# EAGLE design ezlpc-proto (EAGLE 6.5.0)
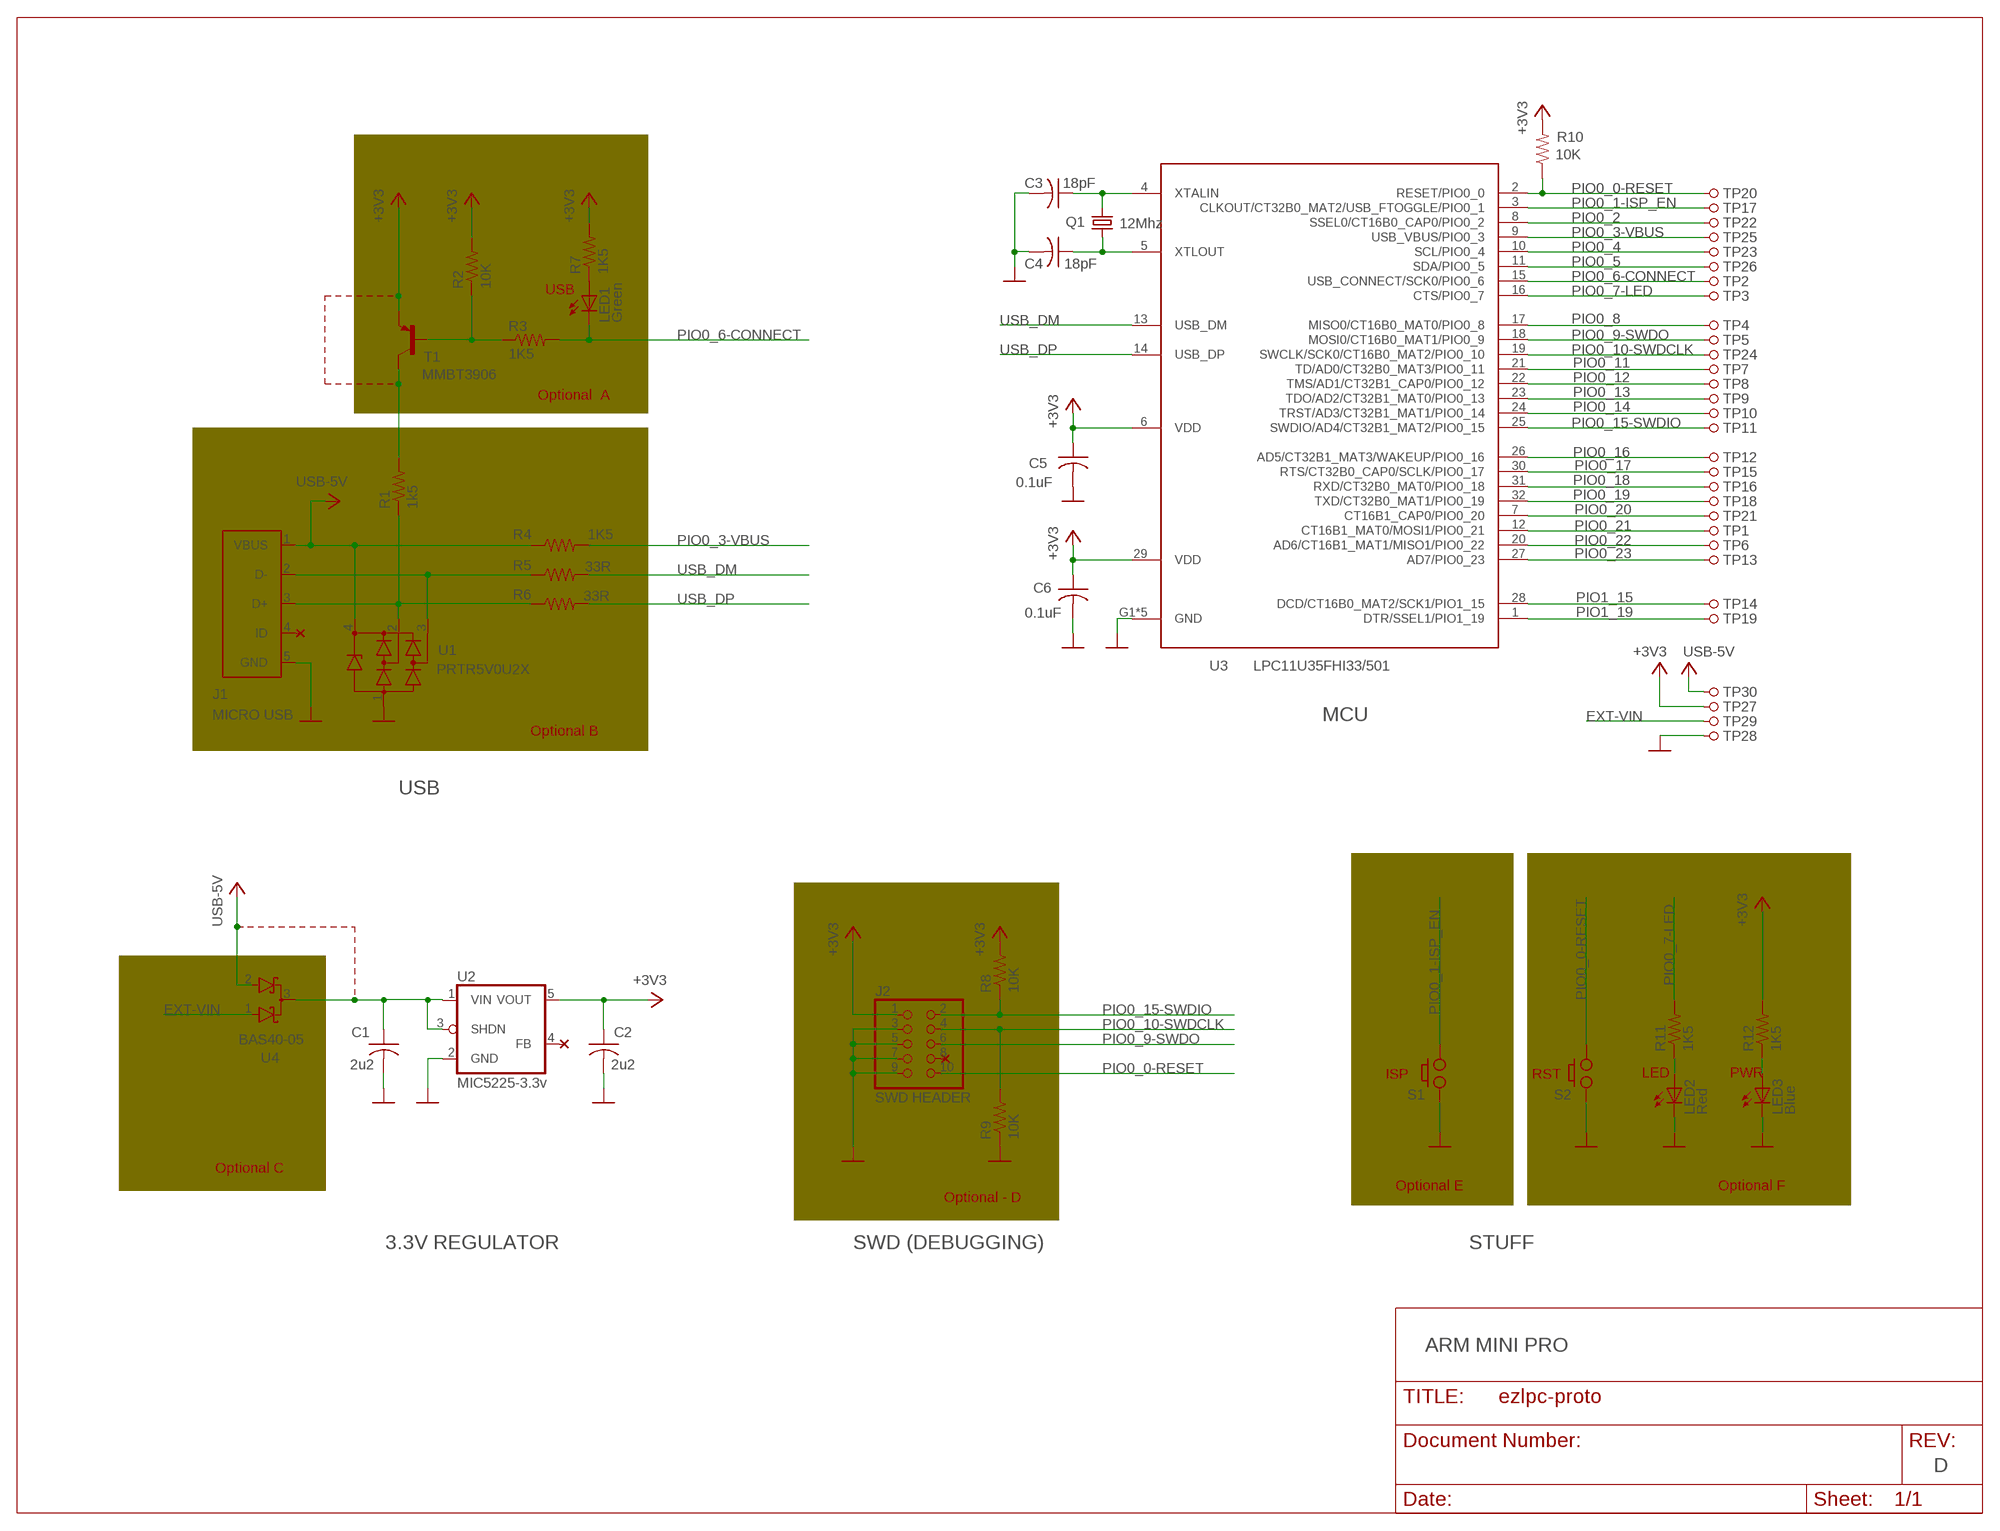
[diagram p0: schematic, sheet 1]

## Parts
C1  2u2  CAPACITORC0603K  [C0603K]
C2  2u2  CAPACITORC0603K  [C0603K]
C3  18pF  C-USC0402K  [C0402K]
C4  18pF  C-USC0402K  [C0402K]
C5  0.1uF  CAPACITORC0603K  [C0603K]
C6  0.1uF  CAPACITORC0603K  [C0603K]
J1  MICRO USB  USB  [USB-MICRO-ZX62RD-AB-5P8]
J2  SWD HEADER  SWD-HEADER  [SWD-HEADER]
LED1  Green  LEDCHIP-LED0603  [CHIP-LED0603]
LED2  Red  LEDCHIP-LED0603  [CHIP-LED0603]
LED3  Blue  LEDCHIP-LED0603  [CHIP-LED0603]
Q1  12Mhz  CRYSTALCTS406  [CRYSTAL]
R1  1k5  R-US_R0402  [R0402]
R2  10K  R-US_R0402  [R0402]
R3  1K5  R-US_R0402  [R0402]
R4  1K5  R-US_R0402  [R0402]
R5  33R  R-US_R0402  [R0402]
R6  33R  R-US_R0402  [R0402]
R7  1K5  R-US_R0402  [R0402]
R8  10K  R-US_R0402  [R0402]
R9  10K  R-US_R0402  [R0402]
R10  10K  R-US_R0402  [R0402]
R11  1K5  R-US_R0402  [R0402]
R12  1K5  R-US_R0402  [R0402]
S1  PUSH_BUTTON  [PUSH_BUTTON]
S2  PUSH_BUTTON  [PUSH_BUTTON]
T1  MMBT3906  BC857B-PNP-SOT23-BEC  [SOT23-BEC]
TP1  HDR1  PINHD-1X1SQUARE  [1X01-SQUARE]
TP2  HDR1  PINHD-1X1  [1X01]
TP3  HDR1  PINHD-1X1  [1X01]
TP4  HDR1  PINHD-1X1  [1X01]
TP5  HDR1  PINHD-1X1  [1X01]
TP6  HDR1  PINHD-1X1  [1X01]
TP7  HDR1  PINHD-1X1  [1X01]
TP8  HDR1  PINHD-1X1  [1X01]
TP9  HDR1  PINHD-1X1  [1X01]
TP10  HDR1  PINHD-1X1  [1X01]
TP11  HDR1  PINHD-1X1  [1X01]
TP12  HDR1  PINHD-1X1  [1X01]
TP13  HDR1  PINHD-1X1  [1X01]
TP14  HDR1  PINHD-1X1  [1X01]
TP15  HDR1  PINHD-1X1  [1X01]
TP16  HDR1  PINHD-1X1  [1X01]
TP17  HDR1  PINHD-1X1  [1X01]
TP18  HDR1  PINHD-1X1  [1X01]
TP19  HDR1  PINHD-1X1  [1X01]
TP20  HDR1  PINHD-1X1  [1X01]
TP21  HDR1  PINHD-1X1  [1X01]
TP22  HDR1  PINHD-1X1  [1X01]
TP23  HDR1  PINHD-1X1  [1X01]
TP24  HDR1  PINHD-1X1  [1X01]
TP25  HDR1  PINHD-1X1  [1X01]
TP26  HDR1  PINHD-1X1  [1X01]
TP27  HDR1  PINHD-1X1  [1X01]
TP28  HDR1  PINHD-1X1  [1X01]
TP29  HDR1  PINHD-1X1  [1X01]
TP30  HDR1  PINHD-1X1  [1X01]
U1  PRTR5V0U2X  [SOT143B]
U2  MIC5225-3.3v  TC1015  [SOT25]
U3  LPC11U35FHI33/501  LPC11U35FHN33/501  [HVQFN33-5MM]
U4  BAS40-05  [SOT23]

## Nets
+3V3: C2.1 C5.1 C6.1 J2.1 R2.2 R7.2 R8.2 R10.2 R12.2 T1.E TP27.1 U2.5(VOUT) U3.6(VDD) U3.29(VDD)
EXT-VIN: TP29.1 U4.1(A1)
GND: C1.2 C2.2 C3.2 C4.2 C5.2 C6.2 J1.5(GND) J2.3 J2.5 J2.7 J2.9 LED2.C LED3.C R9.1 S1.A1 S2.A1 TP28.1 U1.1(GND) U2.2(GND) U3.G1(GND) U3.G2(GND) U3.G3(GND) U3.G4(GND) U3.TAB(GND)
N$1: C3.1 Q1.3 U3.4(XTALIN)
N$2: LED3.A R12.1
N$3: C4.1 Q1.1 U3.5(XTLOUT)
N$4: R2.1 R3.1 T1.B
N$5: R1.2 T1.C
N$6: LED2.A R11.1
N$7: LED1.A R7.1
N$8: J1.3(D+) R1.1 R6.1 U1.2(IO1)
N$9: J1.2(D-) R5.1 U1.3(IO2)
N$10: C1.1 U2.1(VIN) U2.3(SHDN) U4.3(C)
PIO0_0-RESET: J2.10 R10.1 S2.B2 TP20.1 U3.2(RESET/PIO0_0)
PIO0_1-ISP_EN: S1.B2 TP17.1 U3.3(CLKOUT/CT32B0_MAT2/USB_FTOGGLE/PIO0_1)
PIO0_2: TP22.1 U3.8(SSEL0/CT16B0_CAP0/PIO0_2)
PIO0_3-VBUS: R4.2 TP25.1 U3.9(USB_VBUS/PIO0_3)
PIO0_4: TP23.1 U3.10(SCL/PIO0_4)
PIO0_5: TP26.1 U3.11(SDA/PIO0_5)
PIO0_6-CONNECT: LED1.C R3.2 TP2.1 U3.15(USB_CONNECT/SCK0/PIO0_6)
PIO0_7-LED: R11.2 TP3.1 U3.16(CTS/PIO0_7)
PIO0_8: TP4.1 U3.17(MISO0/CT16B0_MAT0/PIO0_8)
PIO0_9-SWDO: J2.6 TP5.1 U3.18(MOSI0/CT16B0_MAT1/PIO0_9)
PIO0_10-SWDCLK: J2.4 R9.2 TP24.1 U3.19(SWCLK/SCK0/CT16B0_MAT2/PIO0_10)
PIO0_11: TP7.1 U3.21(TD/AD0/CT32B0_MAT3/PIO0_11)
PIO0_12: TP8.1 U3.22(TMS/AD1/CT32B1_CAP0/PIO0_12)
PIO0_13: TP9.1 U3.23(TDO/AD2/CT32B1_MAT0/PIO0_13)
PIO0_14: TP10.1 U3.24(TRST/AD3/CT32B1_MAT1/PIO0_14)
PIO0_15-SWDIO: J2.2 R8.1 TP11.1 U3.25(SWDIO/AD4/CT32B1_MAT2/PIO0_15)
PIO0_16: TP12.1 U3.26(AD5/CT32B1_MAT3/WAKEUP/PIO0_16)
PIO0_17: TP15.1 U3.30(RTS/CT32B0_CAP0/SCLK/PIO0_17)
PIO0_18: TP16.1 U3.31(RXD/CT32B0_MAT0/PIO0_18)
PIO0_19: TP18.1 U3.32(TXD/CT32B0_MAT1/PIO0_19)
PIO0_20: TP21.1 U3.7(CT16B1_CAP0/PIO0_20)
PIO0_21: TP1.1 U3.12(CT16B1_MAT0/MOSI1/PIO0_21)
PIO0_22: TP6.1 U3.20(AD6/CT16B1_MAT1/MISO1/PIO0_22)
PIO0_23: TP13.1 U3.27(AD7/PIO0_23)
PIO1_15: TP14.1 U3.28(DCD/CT16B0_MAT2/SCK1/PIO1_15)
PIO1_19: TP19.1 U3.1(DTR/SSEL1/PIO1_19)
USB-5V: J1.1(VBUS) R4.1 TP30.1 U1.4(VCC) U4.2(A2)
USB_DM [critical]: R5.2 U3.13(USB_DM)
USB_DP [critical]: R6.2 U3.14(USB_DP)
Unconnected: J1.4(ID) J2.8 U2.4(FB)

## Notes on the sheet
- USB
- Optional  A
- MCU
- Optional B
- USB
- ISP | RST | LED | PWR
- Optional C
- Optional E | Optional F
- Optional - D
- 3.3V REGULATOR | SWD (DEBUGGING) | STUFF
- ARM MINI PRO
- D

## Library data of the parts
C1 C2 C5 C6 = ezlpc-proto:CAPACITOR: CAPACITOR, American symbol
C3 C4 = ezlpc-proto:C-US: CAPACITOR, American symbol
J1 = ezlpc-proto:USB
J2 = ezlpc-proto:SWD-HEADER: PIN HEADER
LED1-LED3 = ezlpc-proto:LED: LED OSRAM: - CHIPLED LG R971, LG N971, LY N971, LG Q971, LY Q971, LO R971, LY R971 LH N974, LH R974 LS Q976, LO Q976, LY Q976 LO Q996 - Hyper CHIPLED LW Q18S LB Q993, LB Q99A, LB R99A - SideLED LS A670, LO A670, LY A670, LG A670, LP A670 LB A673, LV A673, LT A673, LW A673 LH A674 LY A675 LS A676, LA A676, LO A676, LY A676, LW A676 LS A679, LY A679, LG A679 - Hyper Micro SIDELED® LS Y876, LA Y876, LO Y876, LY Y876 LT Y87S - SmartLED LW L88C, LW L88S LB L89C, LB L89S, LG L890 LS L89K, LO L89K, LY L89K LS L896, LA L896, LO L896, LY L896 - TOPLED LS T670, LO T670, LY T670, LG T670, LP T670 LSG T670, LSP T670, LSY T670, LOP T670, LYG T670 LG T671, LOG T671, LSG T671 LB T673, LV T673, LT T673, LW T673 LH T674 LS T676, LA T676, LO T676, LY T676, LB T676, LH T676, LSB T676, LW T676 LB T67C, LV T67C, LT T67C, LS T67K, LO T67K, LY T67K, LW E67C LS E67B, LA E67B, LO E67B, LY E67B, LB E67C, LV E67C, LT E67C LW T67C LS T679, LY T679, LG T679 LS T770, LO T770, LY T770, LG T770, LP T770 LB T773, LV T773, LT T773, LW T773 LH T774 LS E675, LA E675, LY E675, LS T675 LS T776, LA T776, LO T776, LY T776, LB T776 LHGB T686 LT T68C, LB T68C - Hyper Mini TOPLED® LB M676 - Mini TOPLED Santana® LG M470 LS M47K, LO M47K, LY M47K Source: http://www.osram.convergy.de LUXEON: - LUMILED® LXK2-PW12-R00, LXK2-PW12-S00, LXK2-PW14-U00, LXK2-PW14-V00 LXK2-PM12-R00, LXK2-PM12-S00, LXK2-PM14-U00 LXK2-PE12-Q00, LXK2-PE12-R00, LXK2-PE12-S00, LXK2-PE14-T00, LXK2-PE14-U00 LXK2-PB12-K00, LXK2-PB12-L00, LXK2-PB12-M00, LXK2-PB14-N00, LXK2-PB14-P00, LXK2-PB14-Q00 LXK2-PR12-L00, LXK2-PR12-M00, LXK2-PR14-Q00, LXK2-PR14-R00 LXK2-PD12-Q00, LXK2-PD12-R00, LXK2-PD12-S00 LXK2-PH12-R00, LXK2-PH12-S00 LXK2-PL12-P00, LXK2-PL12-Q00, LXK2-PL12-R00 Source: www.luxeon.com KINGBRIGHT: KA-3528ASYC Source: www.kingbright.com
Q1 = ezlpc-proto:CRYSTAL: CRYSTAL; OC_FARNELL: unknown; OC_NEWARK: unknown
R1-R12 = ezlpc-proto:R-US_: RESISTOR, American symbol
S1 S2 = ezlpc-proto:PUSH_BUTTON: CKN10502CT-ND
T1 = ezlpc-proto:*-PNP-: PNP Transistror
TP1-TP30 = ezlpc-proto:PINHD-1X1: PIN HEADER
U1 = ezlpc-proto:PRTR5V0U2X
U2 = ezlpc-proto:TC1015: 150mA Low Noise LDO Voltage Regulator with Enable TSC [Taiwan Semiconductor Company, Ltd] Source: http://www.taiwansemi.com .. 5205_0409c.pdf
U3 = ezlpc-proto:LPC11U35FHN33/501
U4 = ezlpc-proto:BAS40-05: Silicon Schottky Diodes General-purpose diode for high-speed switching

## Net classes
1 power: width 0.254 mm

## Board
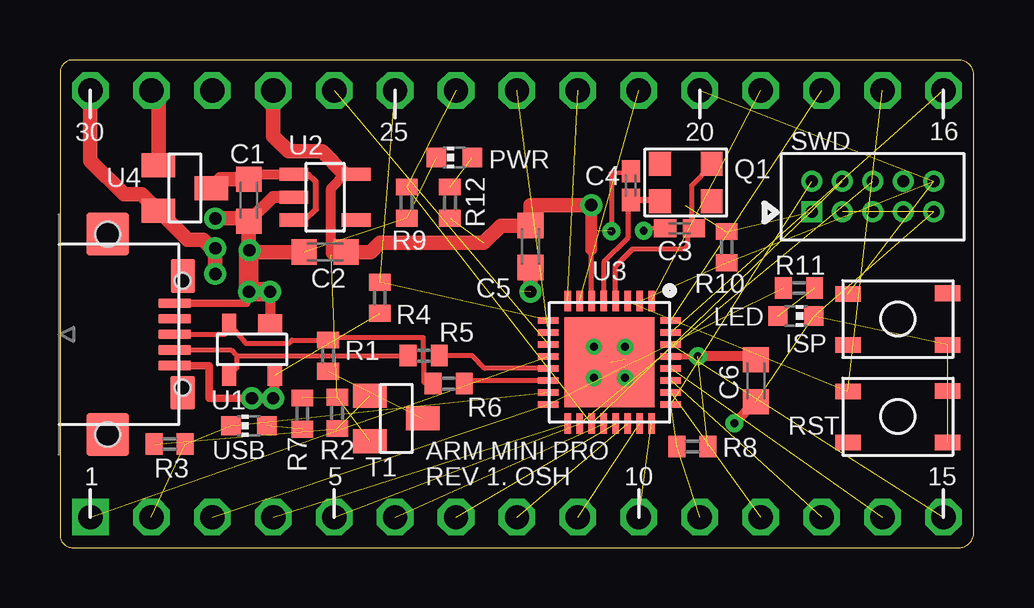
[diagram p1: board, top side]
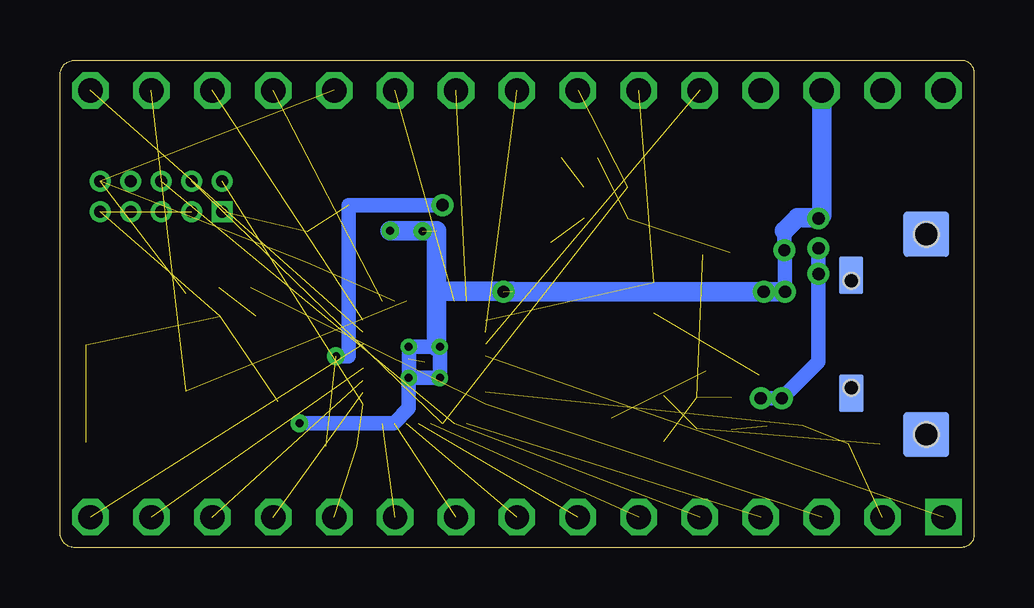
[diagram p2: board, bottom side, seen from below]

Size 38.1 x 20.32 mm. Coordinates in mm from the lower left corner, seen from the top.
Outline: 38.1,0.64 38.1,19.68 arc90 37.47,20.32 0.54,20.32 arc90 0,19.78 0,0.54 arc90 0.54,0 37.47,0 arc90 38.1,0.64
Copper layers (1*16): Top 0.035mm / dielectric 1.5mm / Bottom 0.035mm
Design rules "default *": minimum track width 6mil, minimum drill 13mil, track to track 7mil, track to pad 7mil, pad to pad 8mil, via to via 8mil, smd to smd 0mil, copper to edge 20mil, drill to drill 8mil, minimum pad ring 7mil, minimum via ring 8mil, stop-mask expansion 4mil, vias tented up to drill 20mil, thermal gap 10mil

### Footprints (pad centres in the part's own frame; a part is rotated, then mirrored left to right if it is on the bottom)
C0603K = smd 1.05 x 1.08: 1 -0.875,0; 2 0.875,0
C0402K = smd 0.925 x 0.74: 1 -0.6,0; 2 0.6,0
USB-MICRO-ZX62RD-AB-5P8 = smd 0.4 x 1.35: 1 1.3,5.425; 2 0.65,5.425; 3 0,5.425; 4 -0.65,5.425; 5 -1.3,5.425 | smd 1.778 x 1.778: A1 -4.175,2.625; B1 4.175,2.625 | smd 1.88 x 1.88 bottom: A2 -4.175,2.625; B2 4.175,2.625 | smd 1.422 x 1.016: C1 -2.431,5.757; D1 2.435,5.749 | smd 1.575 x 1.016 bottom: C2 -2.457,5.757; D2 2.461,5.749 | hole 0.65: -2.225,5.75; 2.225,5.75 | hole 1.016: 4.175,2.625; -4.175,2.625
SWD-HEADER = drill 0.508 square: 1 -2.54,-0.635 | drill 0.508: 2 -2.54,0.635; 3 -1.27,-0.635; 4 -1.27,0.635; 5 0,-0.635; 6 0,0.635; 7 1.27,-0.635; 8 1.27,0.635; 9 2.54,-0.635; 10 2.54,0.635
CHIP-LED0603 = smd 0.8 x 0.8: A 0,-0.75; C 0,0.75
CRYSTAL = smd 0.9 x 1: 1 -1.075,-0.775; 2 1.075,-0.775; 3 1.075,0.775; 4 -1.075,0.775
R0402 = smd 0.7 x 0.9: 1 -0.65,0; 2 0.65,0
PUSH_BUTTON = smd 1.05 x 0.65: A1 -2.075,1.075; A2 2.075,1.075; B1 -2.075,-1.075; B2 2.075,-1.05
SOT23-BEC = smd 1 x 1.4: B -0.95,-1.1; C 0,1.1; E 0.95,-1.1
1X01-SQUARE = drill 1.016 square: 1 0,0
1X01 = drill 1.016 octagon: 1 0,0
SOT143B = smd 1 x 0.8: 1 -0.75,-1.075 | smd 0.6 x 0.85: 2 0.95,-1.075; 3 0.95,1.075; 4 -0.95,1.075
SOT25 = smd 0.55 x 1.2: 1 -0.95,-1.3; 2 0,-1.3; 3 0.95,-1.3; 4 0.95,1.3; 5 -0.95,1.3
HVQFN33-5MM = smd 0.85 x 0.27: 1 -2.55,1.75; 2 -2.55,1.25; 3 -2.55,0.75; 4 -2.55,0.25; 5 -2.55,-0.25; 6 -2.55,-0.75; 7 -2.55,-1.25; 8 -2.55,-1.75; 17 2.55,-1.75; 18 2.55,-1.25; 19 2.55,-0.75; 20 2.55,-0.25; 21 2.55,0.25; 22 2.55,0.75; 23 2.55,1.25; 24 2.55,1.75 | smd 0.27 x 0.85: 9 -1.75,-2.55; 10 -1.25,-2.55; 11 -0.75,-2.55; 12 -0.25,-2.55; 13 0.25,-2.55; 14 0.75,-2.55; 15 1.25,-2.55; 16 1.75,-2.55; 25 1.75,2.55; 26 1.25,2.55; 27 0.75,2.55; 28 0.25,2.55; 29 -0.25,2.55; 30 -0.75,2.55; 31 -1.25,2.55; 32 -1.75,2.55 | drill 0.33 pad 0.6: G1 -0.65,0.65; G2 -0.65,-0.65; G3 0.65,-0.65; G4 0.65,0.65 | smd 3.75 x 3.75: TAB 0,0
SOT23 = smd 1 x 1.4: 1 -0.95,-1.1; 2 0.95,-1.1; 3 0,1.1

### Placement (x,y rotation side)
C1  7.87,14.48 270 top
C2  11.05,12.32 180 top
C3  25.83,13.31 180 top
C4  23.8,15.09 90 top
C5  19.61,12.55 270 top
C6  29.01,6.96 270 top
J1  -0.64,8.89 270 top
J2  33.88,14.63 0 top
LED1  7.87,5.08 90 top
LED2  30.68,9.65 270 top
LED3  16.43,16.26 90 top
Q1  26.09,15.21 0 top
R1  11.18,8 270 top
R2  11.56,5.61 90 top
R3  4.57,4.32 0 top
R4  13.34,10.41 90 top
R5  15.16,8 0 top
R6  16.21,6.83 0 top
R7  10.11,5.59 90 top
R8  26.37,4.22 0 top
R9  14.45,14.38 90 top
R10  27.79,12.52 90 top
R11  30.81,10.82 180 top
R12  16.26,14.38 270 top
S1  34.92,5.46 180 top
S2  34.92,9.53 180 top
T1  14.02,5.38 270 top
TP1  1.27,1.27 90 top
TP2  3.81,1.27 0 top
TP3  6.35,1.27 0 top
TP4  8.89,1.27 0 top
TP5  11.43,1.27 0 top
TP6  13.97,1.27 0 top
TP7  16.51,1.27 0 top
TP8  19.05,1.27 0 top
TP9  21.59,1.27 0 top
TP10  24.13,1.27 0 top
TP11  26.67,1.27 0 top
TP12  29.21,1.27 0 top
TP13  31.75,1.27 0 top
TP14  34.29,1.27 0 top
TP15  36.83,1.27 0 top
TP16  36.83,19.05 0 top
TP17  34.29,19.05 0 top
TP18  31.75,19.05 0 top
TP19  29.21,19.05 0 top
TP20  26.67,19.05 0 top
TP21  24.13,19.05 0 top
TP22  21.59,19.05 0 top
TP23  19.05,19.05 0 top
TP24  16.51,19.05 0 top
TP25  13.97,19.05 0 top
TP26  11.43,19.05 0 top
TP27  8.89,19.05 0 top
TP28  6.35,19.05 0 top
TP29  3.81,19.05 0 top
TP30  1.27,19.05 0 top
U1  8,8.26 180 top
U2  11.05,14.61 270 top
U3  22.91,7.72 270 top
U4  5.21,14.99 270 top

### Tracks (layer width: path | path; a pad name or v marks a point on that pad's centre or on a via)
+3V3  (via drill 0.33, 0.51)  (7 unrouted)
  Top 0.203: 22.15,10.28 22.15,12.42
  Top 0.254: U3.6 22.15,10.28 | 29.01,7.97 C6.1 | U3.29 v26.59,7.97 v26.59,7.98
  Top 0.406: C2.1 11.3,12.21 11.3,14.99 11.87,15.55 U2.5 12.38,15.55 | 29.01,7.97 v26.6,7.97
  Top 0.508: 22.15,12.42 v22.15,14.28
  Top 0.61: v26.6,7.97 v26.59,7.98 | v22.15,14.28 19.62,14.28 C5.1 18.38,13.42 17.65,12.7 13.34,12.7 12.95,12.32 C2.1 | 11.87,15.55 10.92,16.51 9.53,16.51 8.89,17.14 TP27.1
  Bottom 0.61: v26.59,7.98 26.06,7.98 26.06,14.28 v22.15,14.28
EXT-VIN
  Top 0.61: TP29.1 4.11,18.75 U4.1
GND  (via drill 0.33, 0.51)  (12 unrouted)
  Top 0.203: 8.76,9.33 U1.1 | C4.2 23.8,15.6 22.99,15.62 v22.99,13.18 | v24.33,13.21 24.26,13.26 24.26,13.34 C3.2
  Top 0.254: 28.99,6.07 C6.2
  Top 0.305: v7.87,10.67 7.78,10.19 J1.5
  Top 0.406: v8.76,10.67 8.76,9.33 | v28.12,5.18 28.99,6.07
  Top 0.508: U2.2 8.88,14.61 C1.2
  Top 0.61: v19.61,10.67 C5.2 | C2.2 7.87,12.32 C1.2 7.76,13.72 v6.48,13.72
  Top 0.813: v8.76,10.67 v7.87,10.67 7.87,12.32
  Bottom 0.254: 23.56,7.85 U3.G1
  Bottom 0.305: U3.G1 23.55,8.36
  Bottom 0.61: U3.G2 U3.G3 U3.G4 23.56,5.8 24.18,5.18 v28.12,5.18 | U3.G1 U3.G2 | 23.55,8.36 23.55,7.09 | 22.4,8.37 U3.G2 | 6.35,13.84 6.45,13.74 v6.48,13.72 | 7.8,12.39 v7.9,12.39 | v7.9,12.39 7.92,12.39 | 7.9,13.21 v7.9,12.39 | 7.87,12.45 7.87,10.72 | 7.87,10.72 v7.87,10.67 | 7.9,10.67 7.9,10.72 | 7.9,10.72 7.87,10.72 | 7.9,10.72 8.79,10.72
  Bottom 0.813: v7.87,10.67 7.9,10.67 v8.76,10.67 v19.61,10.67 | 22.4,10.69 22.4,13.21 v24.33,13.21 | 22.4,10.69 22.4,8.37 | TP28.1 6.35,13.84 | 6.45,13.74 7.37,13.74 7.9,13.21 | 19.23,10.69 22.4,10.69
N$1
  Top 0.203: C3.1 26.34,13.66 26.34,15.09 27.16,15.91 Q1.3 | 26.43,13.15 C3.1 | U3.4 23.16,11.73 23.88,12.45 26.06,12.45 26.19,12.57 26.19,13.06 C3.1
  Top 0.254: 27.34,15.81 Q1.3
N$2  (1 unrouted)
N$3
  Top 0.203: C4.1 23.67,14.36 23.67,12.9 22.66,11.89 U3.5
  Top 0.254: C4.1 24.96,14.49 Q1.1
N$4  (2 unrouted)
N$5  (1 unrouted)
N$6  (1 unrouted)
N$7  (1 unrouted)
N$8
  Top 0.203: J1.3 6.86,8.89 7.05,9.08 U1.2 7.75,8.51 9.53,8.51 9.67,8.65 R1.1 11.29,8.76 15.14,8.76 15.16,6.89 R6.1
N$9
  Top 0.203: J1.2 7.13,8.24 7.37,8 | 7.37,8 R5.1 | 7.18,7.3 U1.3 7.37,7.5 7.37,8
N$10
  Top 0.254: U2.3 10.23,13.65 10.67,14.1 10.67,15.24 10.35,15.55 U2.1
  Top 0.406: C1.1 7.75,15.55 U2.1
  Top 0.61: U4.3 6.32,14.97 6.7,15.35 C1.1
PIO0_0-RESET  (4 unrouted)
PIO0_1-ISP_EN  (2 unrouted)
PIO0_2  (1 unrouted)
PIO0_3-VBUS  (2 unrouted)
PIO0_4  (1 unrouted)
PIO0_5  (1 unrouted)
PIO0_6-CONNECT  (3 unrouted)
PIO0_7-LED  (2 unrouted)
PIO0_8  (1 unrouted)
PIO0_9-SWDO  (2 unrouted)
PIO0_10-SWDCLK  (3 unrouted)
PIO0_11  (1 unrouted)
PIO0_12  (1 unrouted)
PIO0_13  (1 unrouted)
PIO0_14  (1 unrouted)
PIO0_15-SWDIO  (3 unrouted)
PIO0_16  (1 unrouted)
PIO0_17  (1 unrouted)
PIO0_18  (1 unrouted)
PIO0_19  (1 unrouted)
PIO0_20  (1 unrouted)
PIO0_21  (1 unrouted)
PIO0_22  (1 unrouted)
PIO0_23  (1 unrouted)
PIO1_15  (1 unrouted)
PIO1_19  (1 unrouted)
USB-5V  (via drill 0.51)  (1 unrouted)
  Top 0.305: v8,6.22 6.22,6.22 6.22,7.59 J1.1
  Top 0.406: v8,6.22 8.95,6.22 U1.4
  Top 0.61: TP30.1 1.27,16.13 2.67,14.73 3.41,14.73 U4.2 5.32,12.83 5.97,12.83 6.48,12.32 v6.48,11.4
  Bottom 0.61: v6.48,11.4 6.48,11.38 6.48,7.75 v8,6.22 v8.89,6.22 8.89,6.25 | v6.48,11.4 v6.48,12.47 | 6.48,12.5 v6.48,11.4
USB_DM
  Top 0.203: U3.13 17.7,7.47 17.2,8 R5.2
USB_DP
  Top 0.203: R6.2 17.05,6.97 U3.14

### Text on the board
tPlace: 30 | 25 | 20 | SWD | 16 | PWR | LED | ISP | RST | USB | ARM MINI PRO | 1 | 5 | REV 1. OSH | 10 | 15